# Altium project radxa_cm3_io_board_v1360_schematic.PrjPcb (part 5 of 5)

## Sheet 19.IO_Connector.SchDoc: CM3 IO
size 386 x 246 mm; Page Create Date: March  8, 1995; Page Number: 19; Page Size: B; Comment: radxa_1010; Page Count: 20; RevCode: 1.36; Doc: IO_Connector; DsnPath: D:\WMS\黄工\[RC119]CM3_IO_V1.36\对外资料\radxa_cm3_io_board_v1360.DSN; SchematicName: CM3_IO V1.36; PageName: 19.IO_Connector; PageSize: B; TopSchematic: True
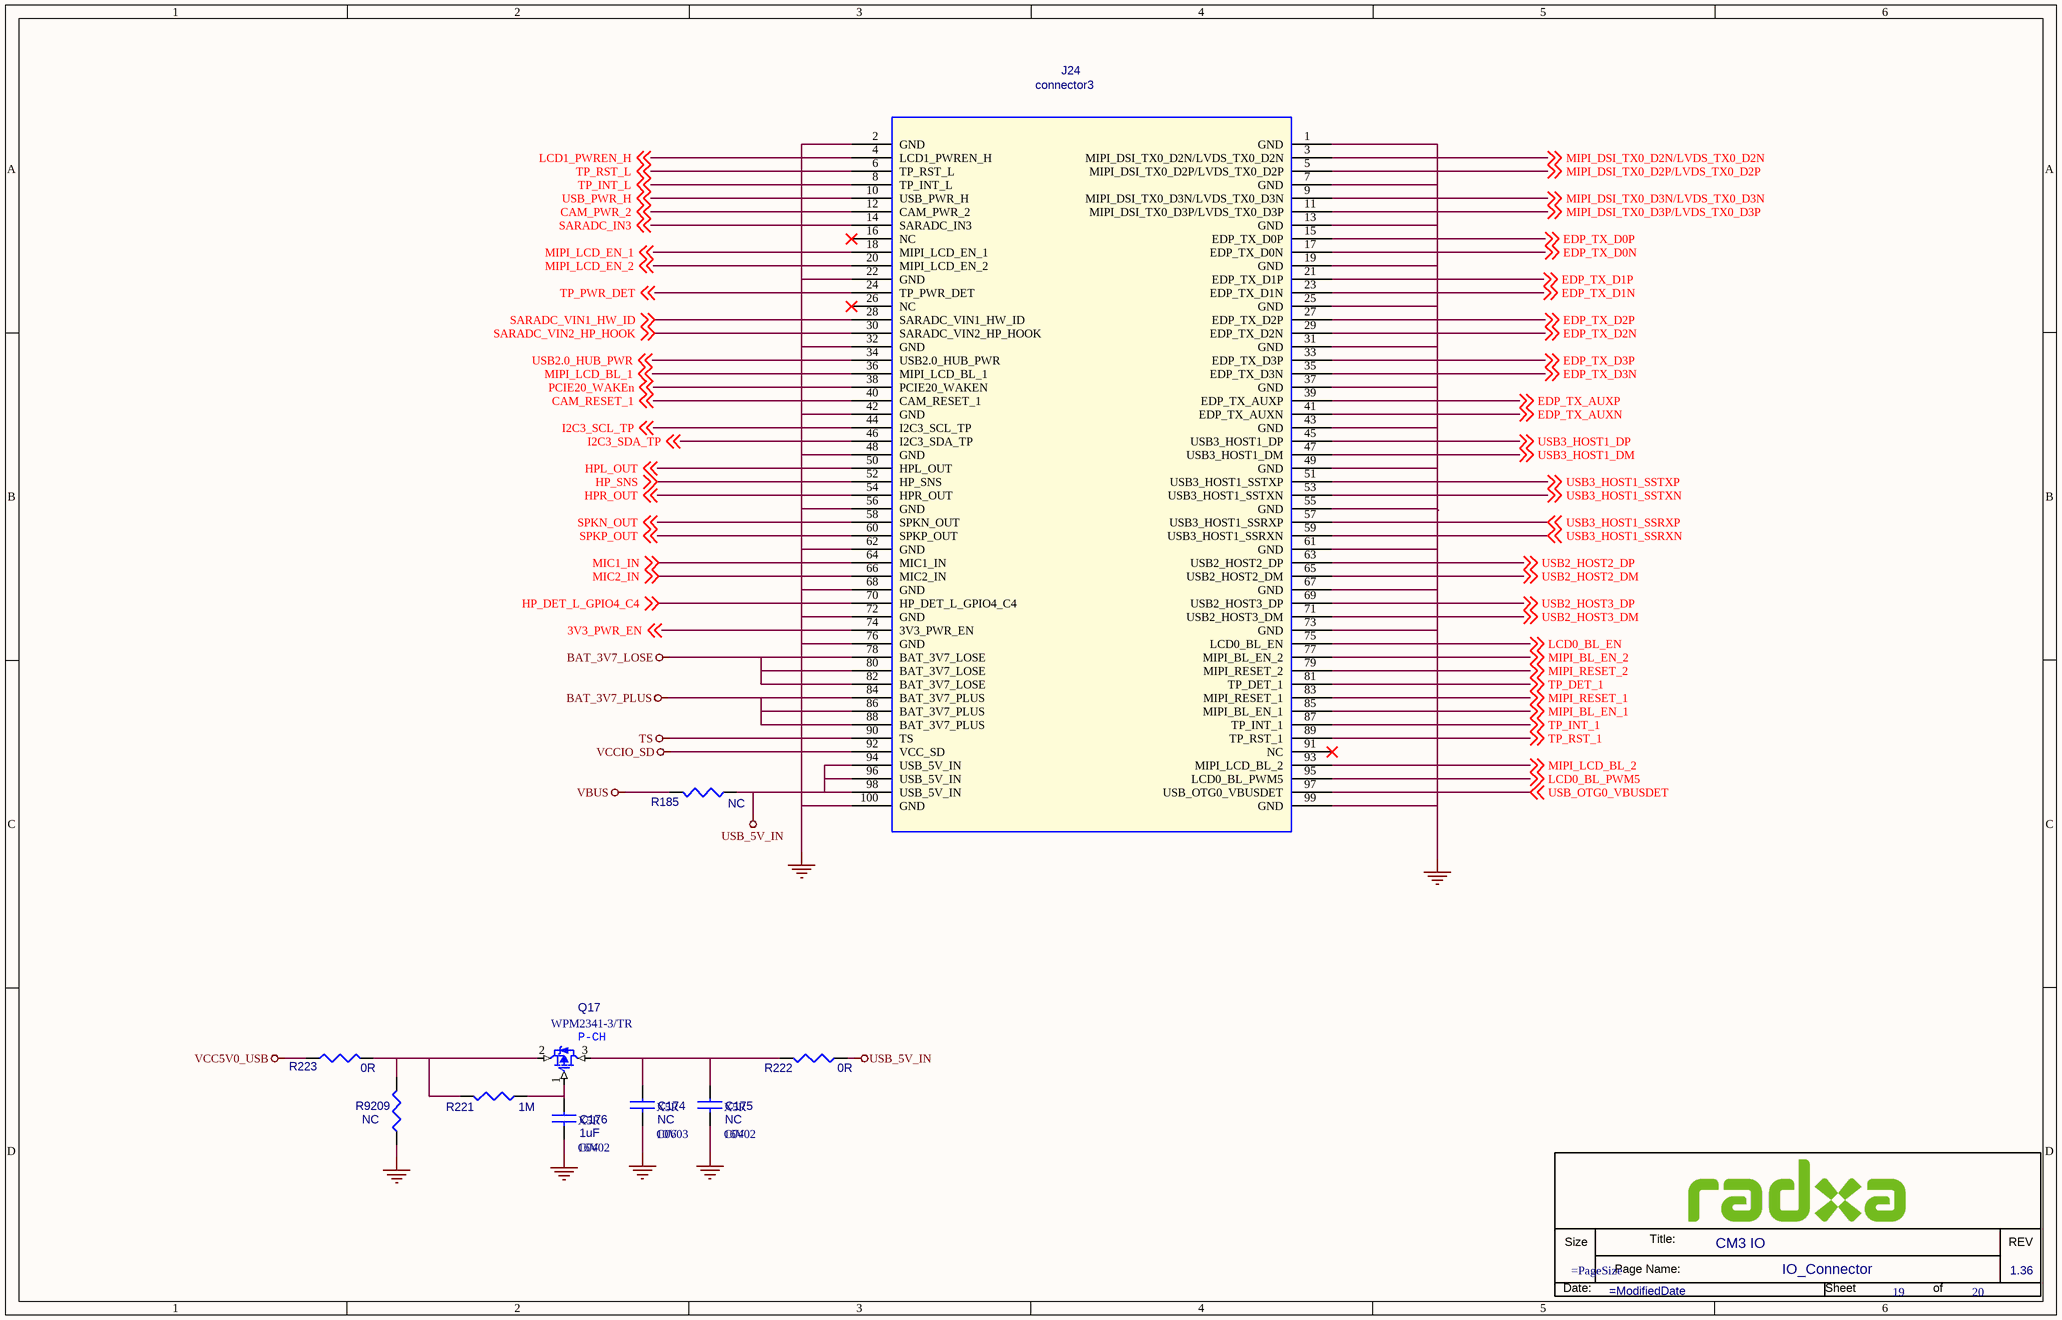
[diagram p17: 19.IO_Connector.SchDoc]

### Parts
(Parts that share a designator on the sheet are numbered #1, #2 ... from top to bottom, then left to right.)
*#18  Doc: IO_Connector  RevCode: 1.36  Title: CM3 IO  Page Number: 19  Page Count: 20  (hidden comment: radxa_1010)  (graphical)
C174  NC  Voltage: 10V  Dielectric: X5R  [C0603]
C175  NC  Voltage: 16V  Dielectric: X5R  [C0402]
C176  1uF  Voltage: 16V  Dielectric: X5R  [C0402]
J24  connector3  [DF40C_100DS]
Q17  WPM2341-3/TR  [S0T-23]
R185  NC  [R0603]
R221  1M  [R0402]
R222  0R  [R0402]
R223  0R  [R0402]
R9209  NC  [R0402]

### Nets
BAT_3V7_LOSE: J24.78(BAT_3V7_LOSE) J24.80(BAT_3V7_LOSE) J24.82(BAT_3V7_LOSE)
BAT_3V7_PLUS: J24.84(BAT_3V7_PLUS) J24.86(BAT_3V7_PLUS) J24.88(BAT_3V7_PLUS)
GND: C174.2 C175.2 C176.2 J24.1(GND) J24.2(GND) J24.7(GND) J24.13(GND) J24.19(GND) J24.22(GND) J24.25(GND) J24.31(GND) J24.32(GND) J24.37(GND) J24.42(GND) J24.43(GND) J24.48(GND) J24.49(GND) J24.55(GND) J24.56(GND) J24.61(GND) J24.62(GND) J24.67(GND) J24.68(GND) J24.72(GND) J24.73(GND) J24.76(GND) J24.99(GND) J24.100(GND) R9209.2
TS: J24.90(TS)
USB_5V_IN: J24.94(USB_5V_IN) J24.96(USB_5V_IN) J24.98(USB_5V_IN) R185.2 R222.2
VBUS: R185.1
VCC5V0_USB: R223.1
VCCIO_SD: J24.92(VCC_SD)
3V3_PWR_EN: J24.74(3V3_PWR_EN) ; off-sheet 3V3_PWR_EN
CAM_PWR_2: J24.12(CAM_PWR_2) ; off-sheet CAM_PWR_2
CAM_RESET_1: J24.40(CAM_RESET_1) ; off-sheet CAM_RESET_1
EDP_TX_AUXN: J24.41(EDP_TX_AUXN) ; off-sheet EDP_TX_AUXN
EDP_TX_AUXP: J24.39(EDP_TX_AUXP) ; off-sheet EDP_TX_AUXP
EDP_TX_D0N: J24.17(EDP_TX_D0N) ; off-sheet EDP_TX_D0N
EDP_TX_D0P: J24.15(EDP_TX_D0P) ; off-sheet EDP_TX_D0P
EDP_TX_D1N: J24.23(EDP_TX_D1N) ; off-sheet EDP_TX_D1N
EDP_TX_D1P: J24.21(EDP_TX_D1P) ; off-sheet EDP_TX_D1P
EDP_TX_D2N: J24.29(EDP_TX_D2N) ; off-sheet EDP_TX_D2N
EDP_TX_D2P: J24.27(EDP_TX_D2P) ; off-sheet EDP_TX_D2P
EDP_TX_D3N: J24.35(EDP_TX_D3N) ; off-sheet EDP_TX_D3N
EDP_TX_D3P: J24.33(EDP_TX_D3P) ; off-sheet EDP_TX_D3P
HP_DET_L_GPIO4_C4: J24.70(HP_DET_L_GPIO4_C4) ; off-sheet HP_DET_L_GPIO4_C4
HP_SNS: J24.52(HP_SNS) ; off-sheet HP_SNS
HPL_OUT: J24.50(HPL_OUT) ; off-sheet HPL_OUT
HPR_OUT: J24.54(HPR_OUT) ; off-sheet HPR_OUT
I2C3_SCL_TP: J24.44(I2C3_SCL_TP) ; off-sheet I2C3_SCL_TP
I2C3_SDA_TP: J24.46(I2C3_SDA_TP) ; off-sheet I2C3_SDA_TP
LCD0_BL_EN: J24.75(LCD0_BL_EN) ; off-sheet LCD0_BL_EN
LCD0_BL_PWM5: J24.95(LCD0_BL_PWM5) ; off-sheet LCD0_BL_PWM5
LCD1_PWREN_H: J24.4(LCD1_PWREN_H) ; off-sheet LCD1_PWREN_H
MIC1_IN: J24.64(MIC1_IN) ; off-sheet MIC1_IN
MIC2_IN: J24.66(MIC2_IN) ; off-sheet MIC2_IN
MIPI_BL_EN_1: J24.85(MIPI_BL_EN_1) ; off-sheet MIPI_BL_EN_1
MIPI_BL_EN_2: J24.77(MIPI_BL_EN_2) ; off-sheet MIPI_BL_EN_2
MIPI_DSI_TX0_D2N/LVDS_TX0_D2N: J24.3(MIPI_DSI_TX0_D2N/LVDS_TX0_D2N) ; off-sheet MIPI_DSI_TX0_D2N/LVDS_TX0_D2N
MIPI_DSI_TX0_D2P/LVDS_TX0_D2P: J24.5(MIPI_DSI_TX0_D2P/LVDS_TX0_D2P) ; off-sheet MIPI_DSI_TX0_D2P/LVDS_TX0_D2P
MIPI_DSI_TX0_D3N/LVDS_TX0_D3N: J24.9(MIPI_DSI_TX0_D3N/LVDS_TX0_D3N) ; off-sheet MIPI_DSI_TX0_D3N/LVDS_TX0_D3N
MIPI_DSI_TX0_D3P/LVDS_TX0_D3P: J24.11(MIPI_DSI_TX0_D3P/LVDS_TX0_D3P) ; off-sheet MIPI_DSI_TX0_D3P/LVDS_TX0_D3P
MIPI_LCD_BL_1: J24.36(MIPI_LCD_BL_1) ; off-sheet MIPI_LCD_BL_1
MIPI_LCD_BL_2: J24.93(MIPI_LCD_BL_2) ; off-sheet MIPI_LCD_BL_2
MIPI_LCD_EN_1: J24.18(MIPI_LCD_EN_1) ; off-sheet MIPI_LCD_EN_1
MIPI_LCD_EN_2: J24.20(MIPI_LCD_EN_2) ; off-sheet MIPI_LCD_EN_2
MIPI_RESET_1: J24.83(MIPI_RESET_1) ; off-sheet MIPI_RESET_1
MIPI_RESET_2: J24.79(MIPI_RESET_2) ; off-sheet MIPI_RESET_2
PCIE20_WAKEn: J24.38(PCIE20_WAKEN) ; off-sheet PCIE20_WAKEn
SARADC_IN3: J24.14(SARADC_IN3) ; off-sheet SARADC_IN3
SARADC_VIN1_HW_ID: J24.28(SARADC_VIN1_HW_ID) ; off-sheet SARADC_VIN1_HW_ID
SARADC_VIN2_HP_HOOK: J24.30(SARADC_VIN2_HP_HOOK) ; off-sheet SARADC_VIN2_HP_HOOK
SPKN_OUT: J24.58(SPKN_OUT) ; off-sheet SPKN_OUT
SPKP_OUT: J24.60(SPKP_OUT) ; off-sheet SPKP_OUT
TP_DET_1: J24.81(TP_DET_1) ; off-sheet TP_DET_1
TP_INT_1: J24.87(TP_INT_1) ; off-sheet TP_INT_1
TP_INT_L: J24.8(TP_INT_L) ; off-sheet TP_INT_L
TP_PWR_DET: J24.24(TP_PWR_DET) ; off-sheet TP_PWR_DET
TP_RST_1: J24.89(TP_RST_1) ; off-sheet TP_RST_1
TP_RST_L: J24.6(TP_RST_L) ; off-sheet TP_RST_L
USB2.0_HUB_PWR: J24.34(USB2.0_HUB_PWR) ; off-sheet USB2.0_HUB_PWR
USB2_HOST2_DM: J24.65(USB2_HOST2_DM) ; off-sheet USB2_HOST2_DM
USB2_HOST2_DP: J24.63(USB2_HOST2_DP) ; off-sheet USB2_HOST2_DP
USB2_HOST3_DM: J24.71(USB2_HOST3_DM) ; off-sheet USB2_HOST3_DM
USB2_HOST3_DP: J24.69(USB2_HOST3_DP) ; off-sheet USB2_HOST3_DP
USB3_HOST1_DM: J24.47(USB3_HOST1_DM) ; off-sheet USB3_HOST1_DM
USB3_HOST1_DP: J24.45(USB3_HOST1_DP) ; off-sheet USB3_HOST1_DP
USB3_HOST1_SSRXN: J24.59(USB3_HOST1_SSRXN) ; off-sheet USB3_HOST1_SSRXN
USB3_HOST1_SSRXP: J24.57(USB3_HOST1_SSRXP) ; off-sheet USB3_HOST1_SSRXP
USB3_HOST1_SSTXN: J24.53(USB3_HOST1_SSTXN) ; off-sheet USB3_HOST1_SSTXN
USB3_HOST1_SSTXP: J24.51(USB3_HOST1_SSTXP) ; off-sheet USB3_HOST1_SSTXP
USB_OTG0_VBUSDET: J24.97(USB_OTG0_VBUSDET) ; off-sheet USB_OTG0_VBUSDET
USB_PWR_H: J24.10(USB_PWR_H) ; off-sheet USB_PWR_H
NetC174_1: C174.1 C175.1 Q17.3(D) R222.1
NetC176_1: C176.1 Q17.1(G) R221.1
NetQ17_2: Q17.2(S) R221.2 R223.2 R9209.1

Not connected (* = marked no-connect by the designer): J24 16(NC)* 26(NC)* 91(NC)*

### Notes on the sheet
- (in symbol P-MOSFET) P-CH
- (in symbol radxa_1010) Size; Title:; REV; Page Name:; Date:; Sheet; of

### Library data of the parts
C174 = CAP NP_0: cap,22.00uF,+/-10%,10V,X5R,C0805; Part Reference: C174; Manufacturer: TDK; RK PN: C2012X5R1A226K125AB; Priority: A; Tolerance: 10%; PCB Footprint: C0603; Value: NC; Part Type: C0805; Manufacturer PN: C2012X5R1A226K125AB; Created by: JJJ
C175 = CAP NP_0: cap,100.00nF,+/-10%,16V,X5R,C0402; Part Reference: C175; Manufacturer: TDK; RK PN: C1005X5R1C104K050BA; Priority: A; Tolerance: 10%; PCB Footprint: C0402; Value: NC; Part Type: C0402; Manufacturer PN: C1005X5R1C104K050BA; Created by: JJJ
C176 = CAP NP_0: cap,100.00nF,+/-10%,16V,X5R,C0402; Part Reference: C176; Manufacturer PN: C1005X5R1C104K050BA; Manufacturer: TDK; Tolerance: 10%; Priority: A; PCB Footprint: C0402; Value: 1uF; Created by: JJJ; Part Type: C0402; RK PN: C1005X5R1C104K050BA
J24 = CN_7: Part Reference: J24; Value: connector3; PCB Footprint: DF40C_100DS
Q17 = P-MOSFET: Part Reference: Q17; SANZ_P/N: SK2301; Value: WPM2341-3/TR; Part Type: MOS管; PCB Footprint: S0T-23
R185 = RESISTOR_0: 通用厚膜电阻,330R,+/-5%,R0402,1/16W.; Part Reference: R185; Manufacturer: YAGEO; RK PN: RC0402JR-07330RL; Priority: A; Tolerance: 5%; Wattage: 1/16W; Value: NC; Part Type: 通用厚膜电阻; Manufacturer PN: RC0402JR-07330RL; Created by: YTL; PCB Footprint: R0603
R221 = RESISTOR_1: RES,thick film,47KOhm,+/-5%,1/16W,SMD0402; Part Reference: R221; Value: 1M; PCB Footprint: R0402
R222 = RESISTOR_0: 通用厚膜电阻,330R,+/-5%,R0402,1/16W.; Part Reference: R222; Manufacturer PN: RC0402JR-07330RL; Manufacturer: YAGEO; Wattage: 1/16W; Tolerance: 5%; Priority: A; Value: 0R; Created by: YTL; Part Type: 通用厚膜电阻; RK PN: RC0402JR-07330RL; PCB Footprint: R0402
R223 = RESISTOR_0: 通用厚膜电阻,330R,+/-5%,R0402,1/16W.; Part Reference: R223; Manufacturer PN: RC0402JR-07330RL; Manufacturer: YAGEO; Wattage: 1/16W; Tolerance: 5%; Priority: A; Value: 0R; Created by: YTL; Part Type: 通用厚膜电阻; RK PN: RC0402JR-07330RL; PCB Footprint: R0402
R9209 = RESISTOR_0: 通用厚膜电阻,100R,+/-5%,R0402,1/16W.; Part Reference: R9209; Manufacturer PN: RC0402JR-07100RL; Manufacturer: YAGEO; Wattage: 1/16W; Tolerance: 5%; Priority: A; Value: NC; Created by: YTL; Part Type: 通用厚膜电阻; RK PN: RC0402JR-07100RL; PCB Footprint: R0402
*#18 = radxa_1010: Page Create Date: March  8, 1995; Page Size: =PageSize; Page Modify Date: =ModifiedDate

## Sheet 20.MIPI_LCD_TX1.SchDoc: CM3 IO
size 420 x 297 mm; Page Create Date: March  8, 1995; Page Number: 20; Page Size: A3; Comment: radxa_1010; Page Count: 20; RevCode: 1.36; Doc: MIPI_LCD_TX1; DsnPath: D:\WMS\黄工\[RC119]CM3_IO_V1.36\对外资料\radxa_cm3_io_board_v1360.DSN; SchematicName: CM3_IO V1.36; PageName: 20.MIPI_LCD_TX1; PageSize: A3; TopSchematic: True
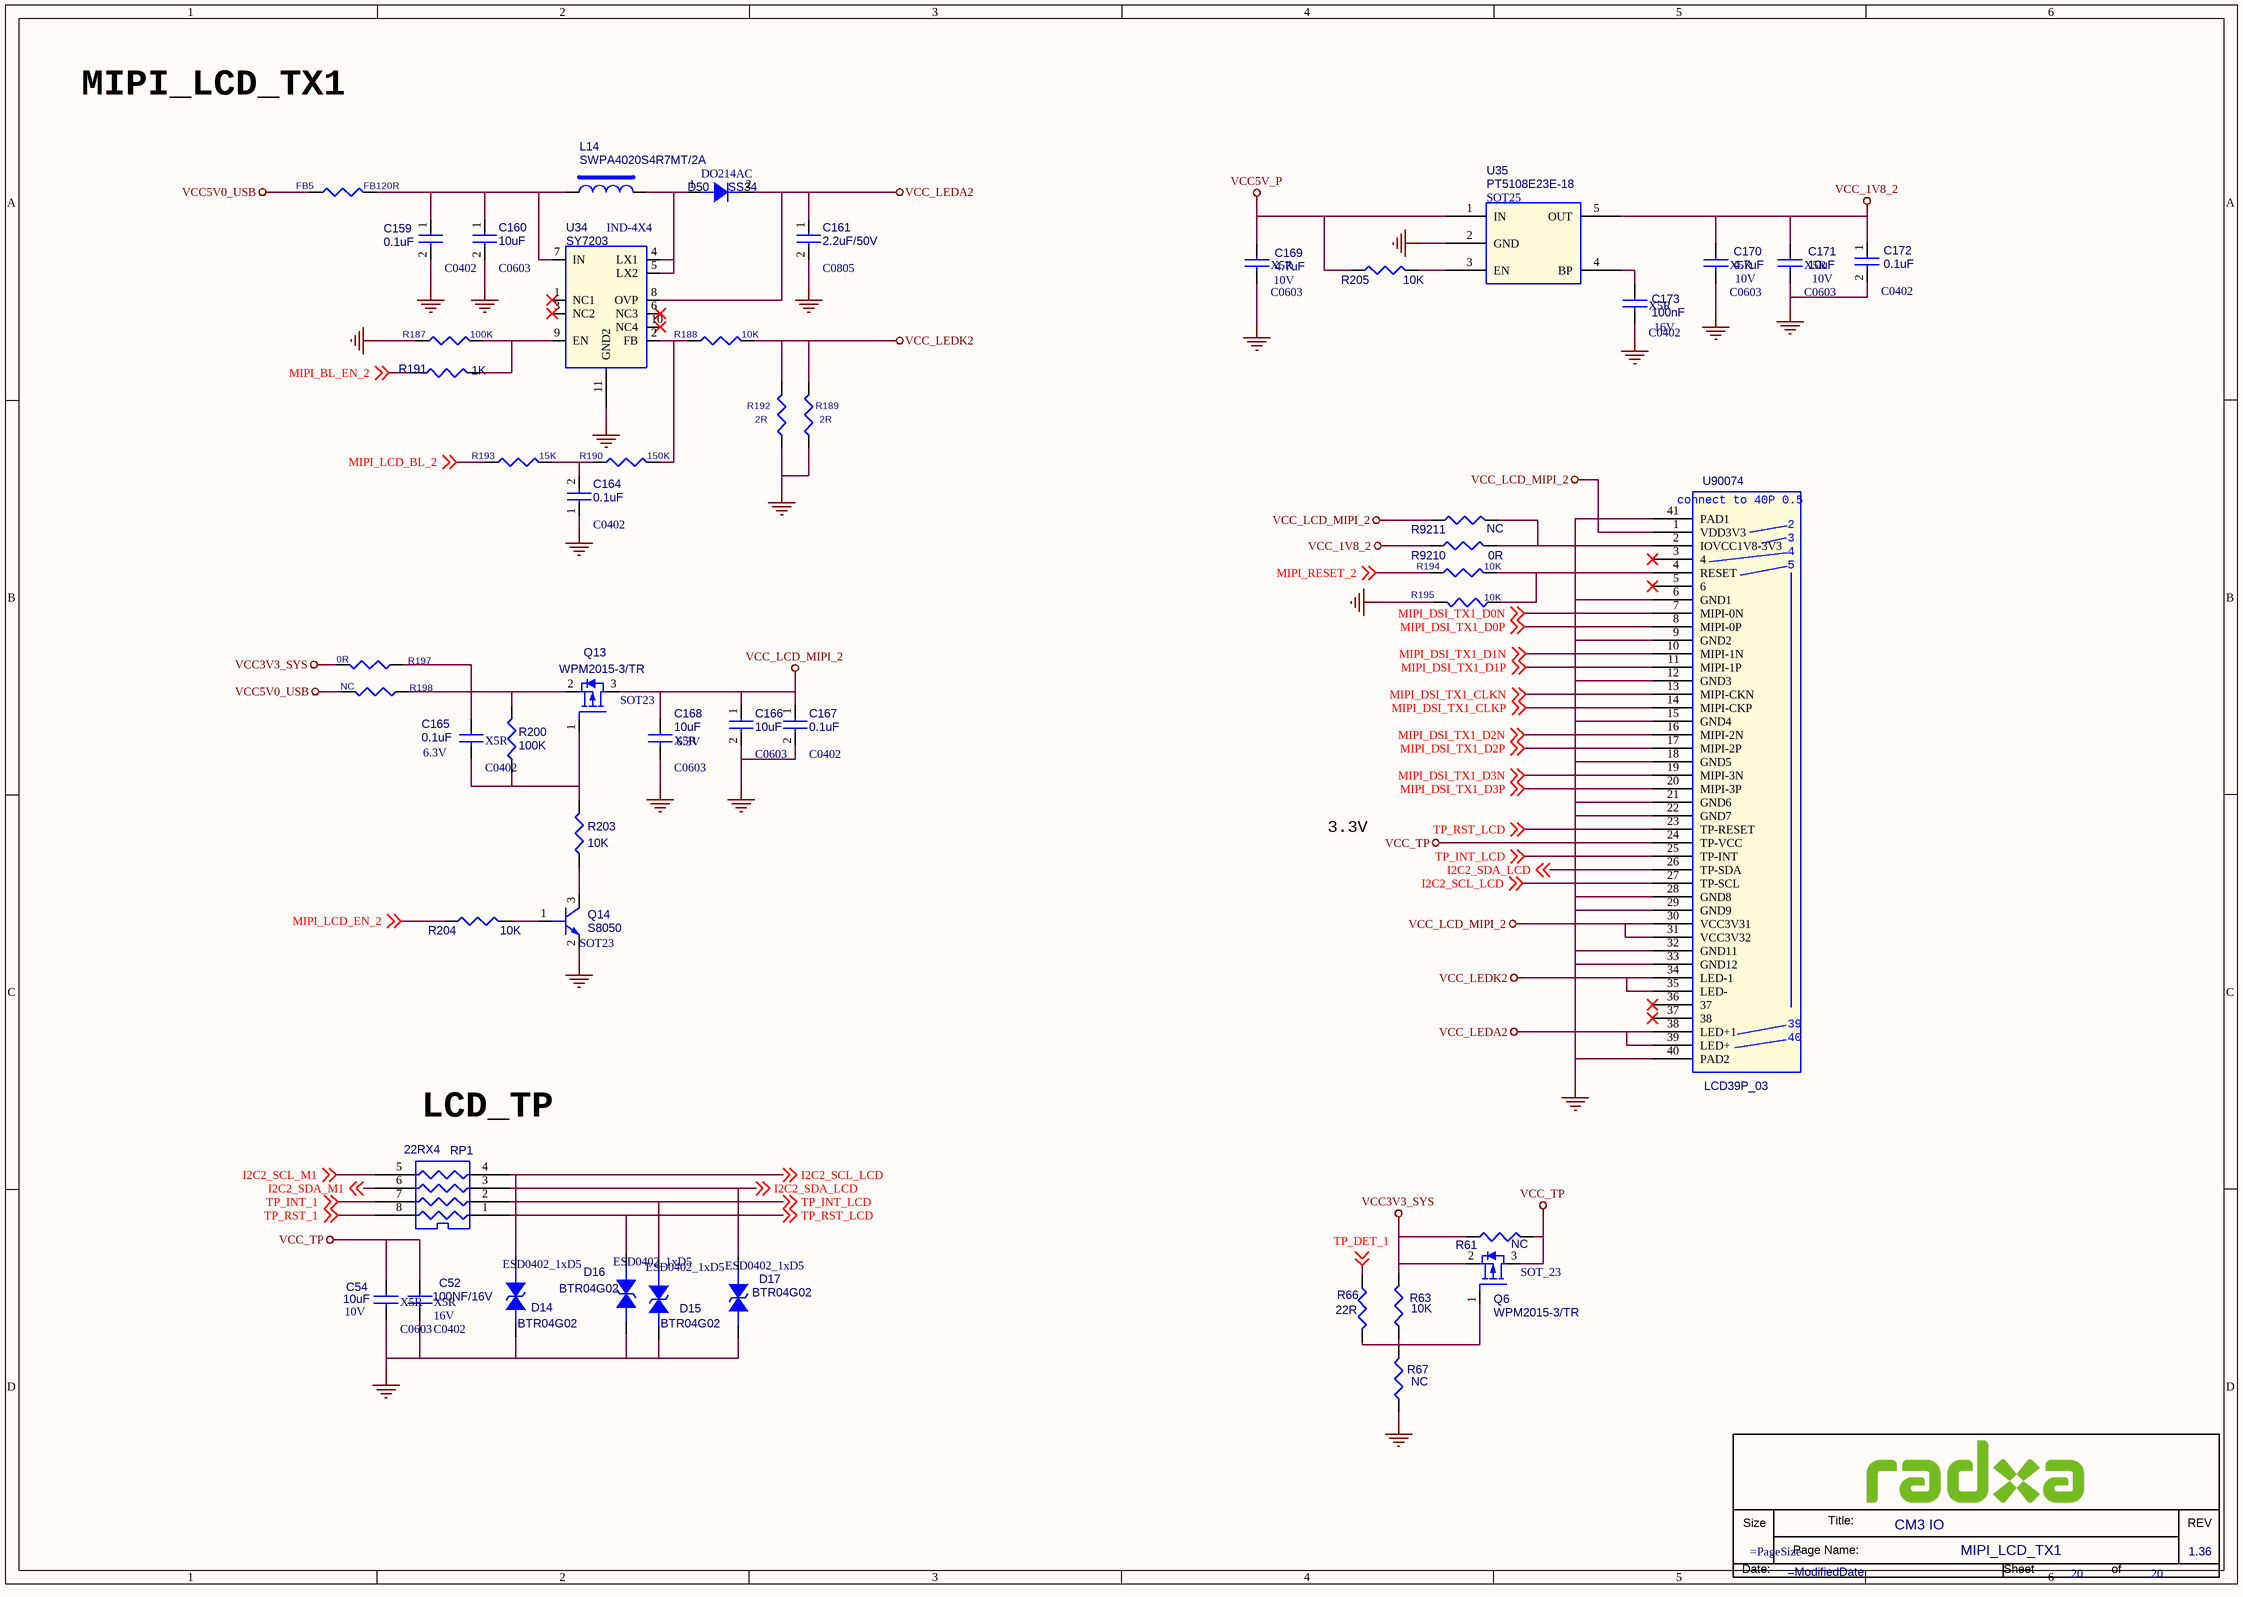
[diagram p18: 20.MIPI_LCD_TX1.SchDoc]

### Parts
(Parts that share a designator on the sheet are numbered #1, #2 ... from top to bottom, then left to right.)
*#19  Doc: MIPI_LCD_TX1  RevCode: 1.36  Title: CM3 IO  Page Number: 20  (hidden comment: radxa_1010)  (graphical)
C52  100NF/16V  Voltage: 16V  Dielectric: X5R  [C0402]
C54  10uF  Voltage: 10V  Dielectric: X5R  [C0603]
C159  0.1uF  [C0402]
C160  10uF  [C0603]
C161  2.2uF/50V  [C0805]
C164  0.1uF  [C0402]
C165  0.1uF  Voltage: 6.3V  Dielectric: X5R  [C0402]
C166  10uF  [C0603]
C167  0.1uF  [C0402]
C168  10uF  Voltage: 6.3V  Dielectric: X5R  [C0603]
C169  4.7uF  Voltage: 10V  Dielectric: X5R  [C0603]
C170  4.7uF  Voltage: 10V  Dielectric: X5R  [C0603]
C171  10uF  Voltage: 10V  Dielectric: X5R  [C0603]
C172  0.1uF  [C0402]
C173  100nF  Voltage: 16V  Dielectric: X5R  [C0402]
D14  BTR04G02  [ESD0402_1xD5]
D15  BTR04G02  [ESD0402_1xD5]
D16  BTR04G02  [ESD0402_1xD5]
D17  BTR04G02  [ESD0402_1xD5]
D50  SS34  [DO214AC]
FB5  FB120R  [R0603]
L14  SWPA4020S4R7MT/2A  [IND-4X4]
Q6  WPM2015-3/TR  PCB Footprint: SOT_23  [SOT23]
Q13  WPM2015-3/TR  [SOT23]
Q14  S8050  [SOT23]
R61  NC  [R0402]
R63  10K  [R0402]
R66  22R  [R0402]
R67  NC  [R0402]
R187  100K  [R0402]
R188  10K  [R0402]
R189  2R  [R0805]
R190  150K  [R0402]
R191  1K  [R0402]
R192  2R  [R0805]
R193  15K  [R0402]
R194  10K  [R0402]
R195  10K  [R0402]
R197  0R  [R0603]
R198  NC  [R0603]
R200  100K  [R0402]
R203  10K  [R0402]
R204  10K  [R0402]
R205  10K  [R0402]
R9210  0R  [R0402]
R9211  NC  [R0402]
RP1  22RX4  [RN8P4RC]
U34  SY7203  [QFN8-2X2]
U35  PT5108E23E-18  [SOT25]
U90074  LCD39P_03  [LCD39PIN-ok]

### Nets
GND: C52.2 C54.2 C159.2 C160.2 C161.2 C164.1 C166.2 C167.2 C168.2 C169.2 C170.2 C171.2 C172.2 C173.2 D14.2 D15.2 D16.2 D17.2 Q14.2(EMITTER) R67.1 R187.1 R189.2 R192.2 R195.2 U34.11(GND2) U35.2(GND) U90074.6(GND1) U90074.9(GND2) U90074.12(GND3) U90074.15(GND4) U90074.18(GND5) U90074.21(GND6) U90074.22(GND7) U90074.28(GND8) U90074.29(GND9) U90074.32(GND11) U90074.33(GND12) U90074.40(PAD2) U90074.41(PAD1)
VCC3V3_SYS: Q6.2(SOURCE) R61.1 R63.2 R197.1
VCC5V0_USB: FB5.1 R198.1
VCC5V_P: C169.1 R205.1 U35.1(IN)
VCC_1V8_2: C170.1 C171.1 C172.1 R9210.1 U35.5(OUT)
VCC_LCD_MIPI_2: C166.1 C167.1 C168.1 Q13.3(DRAIN) R9211.1 U90074.1(VDD3V3) U90074.30(VCC3V31) U90074.31(VCC3V32)
VCC_LEDA2: C161.1 D50.2(K) U34.8(OVP) U90074.38(LED+1) U90074.39(LED+)
VCC_LEDK2: R188.2 R189.1 R192.1 U90074.34(LED-1) U90074.35(LED-)
VCC_TP: C52.1 C54.1 Q6.3(DRAIN) R61.2 U90074.24(TP-VCC)
I2C2_SCL_LCD: D14.1 RP1.4(R4) U90074.27(TP-SCL) ; off-sheet I2C2_SCL_LCD
I2C2_SCL_M1: RP1.5(R4) ; off-sheet I2C2_SCL_M1
I2C2_SDA_LCD: D17.1 RP1.3(R3) U90074.26(TP-SDA) ; off-sheet I2C2_SDA_LCD
I2C2_SDA_M1: RP1.6(R3) ; off-sheet I2C2_SDA_M1
MIPI_BL_EN_2: R191.1 ; off-sheet MIPI_BL_EN_2
MIPI_DSI_TX1_CLKN: U90074.13(MIPI-CKN) ; off-sheet MIPI_DSI_TX1_CLKN
MIPI_DSI_TX1_CLKP: U90074.14(MIPI-CKP) ; off-sheet MIPI_DSI_TX1_CLKP
MIPI_DSI_TX1_D0N: U90074.7(MIPI-0N) ; off-sheet MIPI_DSI_TX1_D0N
MIPI_DSI_TX1_D0P: U90074.8(MIPI-0P) ; off-sheet MIPI_DSI_TX1_D0P
MIPI_DSI_TX1_D1N: U90074.10(MIPI-1N) ; off-sheet MIPI_DSI_TX1_D1N
MIPI_DSI_TX1_D1P: U90074.11(MIPI-1P) ; off-sheet MIPI_DSI_TX1_D1P
MIPI_DSI_TX1_D2N: U90074.16(MIPI-2N) ; off-sheet MIPI_DSI_TX1_D2N
MIPI_DSI_TX1_D2P: U90074.17(MIPI-2P) ; off-sheet MIPI_DSI_TX1_D2P
MIPI_DSI_TX1_D3N: U90074.19(MIPI-3N) ; off-sheet MIPI_DSI_TX1_D3N
MIPI_DSI_TX1_D3P: U90074.20(MIPI-3P) ; off-sheet MIPI_DSI_TX1_D3P
MIPI_LCD_BL_2: R193.1 ; off-sheet MIPI_LCD_BL_2
MIPI_LCD_EN_2: R204.1 ; off-sheet MIPI_LCD_EN_2
MIPI_RESET_2: R194.1 ; off-sheet MIPI_RESET_2
TP_DET_1: R66.1 ; off-sheet TP_DET_1
TP_INT_1: RP1.7(R2) ; off-sheet TP_INT_1
TP_INT_LCD: D15.1 RP1.2(R2) U90074.25(TP-INT) ; off-sheet TP_INT_LCD
TP_RST_1: RP1.8(R1) ; off-sheet TP_RST_1
TP_RST_LCD: D16.1 RP1.1(R1) U90074.23(TP-RESET) ; off-sheet TP_RST_LCD
NetC159_1: C159.1 C160.1 FB5.2 L14.1 U34.7(IN)
NetC164_2: C164.2 R190.1 R193.2
NetC165_1: C165.1 Q13.2(SOURCE) R197.2 R198.2 R200.1
NetC165_2: C165.2 Q13.1(GATE) R200.2 R203.1
NetC173_1: C173.1 U35.4(BP)
NetD50_1: D50.1(A) L14.2 U34.4(LX1) U34.5(LX2)
NetQ6_1: Q6.1(GATE) R63.1 R66.2 R67.2
NetQ14_1: Q14.1(BASE) R204.2
NetQ14_3: Q14.3(COLLECTOR) R203.2
NetR187_2: R187.2 R191.2 U34.9(EN)
NetR188_1: R188.1 R190.2 U34.2(FB)
NetR194_2: R194.2 R195.1 U90074.4(RESET)
NetR205_2: R205.2 U35.3(EN)
NetR9210_2: R9210.2 R9211.2 U90074.2(IOVCC1V8-3V3)

Not connected (* = marked no-connect by the designer): U34 1(NC1)* 3(NC2)* 6(NC3)* 10(NC4)*; U90074 3(4)* 5(6)* 36(37)* 37(38)*

### Notes on the sheet
- MIPI_LCD_TX1
- 3.3V
- (near RP1) LCD_TP
- (in symbol LCD39P_03) connect to 40P 0.5
- (in symbol radxa_1010) Size; Title:; REV; Page Name:; Date:; Sheet; of

### Library data of the parts
C52 = CAP NP_0: cap,100.00nF,+/-10%,16V,X5R,C0402; Part Reference: C52; Manufacturer: TDK; RK PN: C1005X5R1C104K050BA; Priority: A; Tolerance: 10%; PCB Footprint: C0402; Value: 100NF/16V; Part Type: C0402; Manufacturer PN: C1005X5R1C104K050BA; Created by: JJJ
C54 = CAP NP_0: cap,10.00uF,+/-10%,10V,X5R,C0603; Part Reference: C54; Manufacturer PN: C1608X5R1A106K080AC; Manufacturer: TDK; Tolerance: 10%; Priority: A; PCB Footprint: C0603; Value: 10uF; Created by: JJJ; Part Type: C0603; RK PN: C1608X5R1A106K080AC
C159 = CAP NP: CAP,MLCC,100nF,+/-10%,X7R,6.3V,SMD0402; Part Reference: C159; PCB Footprint: C0402; Value: 0.1uF
C160 = CAP NP: Part Reference: C160; PCB Footprint: C0603; Value: 10uF
C161 = CAP NP: RoHS CHIP CAP 1uF +10/-10% 25V X5R; Part Reference: C161; PCB Footprint: C0805; Value: 2.2uF/50V
C164 = CAP NP: RoHS CHIP CAP 0.1uF +10/-10% X7R; Part Reference: C164; PCB Footprint: C0402; Value: 0.1uF
C165 = CAP NP_0: cap,100.00nF,+/-10%,6.3V,X5R,C0402; Part Reference: C165; Manufacturer: TDK; RK PN: C1005X5R0J104K050BA; Priority: A; Tolerance: 10%; PCB Footprint: C0402; Value: 0.1uF; Part Type: C0402; Manufacturer PN: C1005X5R0J104K050BA; Created by: JJJ
C166 = CAP NP: CAP,MLCC,4.7uF,+/-10%,X5R,6.3V,SMD0603; Part Reference: C166; PCB Footprint: C0603; Value: 10uF
C167 = CAP NP: CAP,MLCC,100nF,+/-10%,X7R,6.3V,SMD0402; Part Reference: C167; PCB Footprint: C0402; Value: 0.1uF
C168 = CAP NP_0: cap,4.70uF,+/-10%,6.3V,X5R,C0603; Part Reference: C168; Manufacturer: TDK; RK PN: C1608X5R0J475K080AB; Priority: A; Tolerance: 10%; PCB Footprint: C0603; Value: 10uF; Part Type: C0603; Manufacturer PN: C1608X5R0J475K080AB; Created by: JJJ
C169 = CAP NP_0: cap,4.70uF,+/-10%,10V,X5R,C0603; Part Reference: C169; Manufacturer: TDK; RK PN: C1608X5R1A475K080AC; Priority: A; Tolerance: 10%; PCB Footprint: C0603; Value: 4.7uF; Part Type: C0603; Manufacturer PN: C1608X5R1A475K080AC; Created by: JJJ
C170 = CAP NP_0: cap,4.70uF,+/-10%,10V,X5R,C0603; Part Reference: C170; Manufacturer PN: C1608X5R1A475K080AC; Manufacturer: TDK; Tolerance: 10%; Priority: A; PCB Footprint: C0603; Value: 4.7uF; Created by: JJJ; Part Type: C0603; RK PN: C1608X5R1A475K080AC
C171 = CAP NP_0: cap,10.00uF,+/-10%,10V,X5R,C0805; Part Reference: C171; Manufacturer PN: C2012X5R1A106K125AB; Manufacturer: TDK; Tolerance: 10%; Priority: A; PCB Footprint: C0603; Value: 10uF; Created by: JJJ; Part Type: C0805; RK PN: C2012X5R1A106K125AB
C172 = CAP NP: CAP,MLCC,100nF,+/-10%,X7R,6.3V,SMD0402; Part Reference: C172; PCB Footprint: C0402; Value: 0.1uF
C173 = CAP NP_0: cap,100.00nF,+/-10%,16V,X5R,C0402; Part Reference: C173; Manufacturer: TDK; RK PN: C1005X5R1C104K050BA; Priority: A; Tolerance: 10%; PCB Footprint: C0402; Value: 100nF; Part Type: C0402; Manufacturer PN: C1005X5R1C104K050BA; Created by: JJJ
D14 = DIODE BI_DIR TRIG_0: 1-Line, Bi-directional, Transient Voltage Suppressors.17.5pF.; Part Reference: D14; Manufacturer PN: ESD5451N; Manufacturer: WillSemi(韦尔半导体); OPTION: DNP; Priority: A; PCB Footprint: ESD0402_1xD5; Value: BTR04G02; Created by: JJJ; Part Type: ESD_TVS; RK PN: ESD5451N
D15 = DIODE BI_DIR TRIG_0: 1-Line, Bi-directional, Transient Voltage Suppressors.17.5pF.; Part Reference: D15; Manufacturer: WillSemi(韦尔半导体); RK PN: ESD5451N; Priority: A; OPTION: DNP; PCB Footprint: ESD0402_1xD5; Value: BTR04G02; Part Type: ESD_TVS; Manufacturer PN: ESD5451N; Created by: JJJ
D16 = DIODE BI_DIR TRIG_0: 1-Line, Bi-directional, Transient Voltage Suppressors.17.5pF.; Part Reference: D16; Manufacturer: WillSemi(韦尔半导体); RK PN: ESD5451N; Priority: A; OPTION: DNP; PCB Footprint: ESD0402_1xD5; Value: BTR04G02; Part Type: ESD_TVS; Manufacturer PN: ESD5451N; Created by: JJJ
D17 = DIODE BI_DIR TRIG_0: 1-Line, Bi-directional, Transient Voltage Suppressors.17.5pF.; Part Reference: D17; Manufacturer: WillSemi(韦尔半导体); RK PN: ESD5451N; Priority: A; OPTION: DNP; PCB Footprint: ESD0402_1xD5; Value: BTR04G02; Part Type: ESD_TVS; Manufacturer PN: ESD5451N; Created by: JJJ
D50 = DIODE: Part Reference: D50; PCB Footprint: DO214AC; Value: SS34
FB5 = RES 1B: ROHS CHIP RES 4.7K 1/16W 5%; Part Reference: FB5; Value: FB120R; PCB Footprint: R0603
L14 = INDUCTORS OF FERRITE: Part Reference: L14; PCB Footprint: IND-4X4; Value: SWPA4020S4R7MT/2A
Q6 = MOSFET P: PMOS,WPM2015-3/TR,SOT_23,Id=2.4A,Vds=20V; Part Reference: Q6; Manufacturer: WillSemi(韦尔半导体); ROOM: CHG; Priority: A; Id_max: 2.4A; Vgs: ±8V; VDS: 20V; Vgsth: 0.62V; Pd: 0.5W; option: DNP; Value: WPM2015-3/TR; RK PN: WPM2015-3/TR; Part Type: PMOS; Manufacturer PN: WPM2015-3/TR; Created by: JJJ
Q13 = MOSFET P: PMOS,WPM2015-3/TR,SOT23,Id=2.4A,Vds=20V; Part Reference: Q13; Manufacturer: WillSemi(韦尔半导体); Pd: 0.5W; Vgsth: 0.62V; VDS: 20V; Vgs: ±8V; Id: 2.4A; Priority: A; PCB Footprint: SOT23; Value: WPM2015-3/TR; Created by: JJJ; Manufacturer PN: WPM2015-3/TR; Part Type: PMOS; RK PN: WPM2015-3/TR
Q14 = NPN: S8050 SOT23; Part Reference: Q14; Manufacturer: 长电; Manufacturer PN: S8050_SOT23; Priority: A; Ic: 0.5A; Vceo: 25V; Pc: 0.3W; PCB Footprint: SOT23; Value: S8050; RK PN: S8050; Part Type: NPN; Created by: JJJ
R61 = RESISTOR_0: 通用厚膜电阻,0R,+/-5%,R0402,1/16W.; Part Reference: R61; Manufacturer PN: RC0402JR-070RL; Manufacturer: YAGEO; Wattage: 1/16W; Tolerance: 5%; Priority: A; Value: NC; Created by: YTL; Part Type: 通用厚膜电阻; RK PN: RC0402JR-070RL; PCB Footprint: R0402
R63 = RESISTOR_0: 通用厚膜电阻,10K,+/-5%,R0402,1/16W.; Part Reference: R63; Manufacturer PN: RC0402JR-0710KL; Manufacturer: YAGEO; Wattage: 1/16W; Tolerance: 5%; Priority: A; Value: 10K; Created by: YTL; Part Type: 通用厚膜电阻; RK PN: RC0402JR-0710KL; PCB Footprint: R0402
R66 = RESISTOR_0: 通用厚膜电阻,100K,+/-5%,R0402,1/16W.; Part Reference: R66; Manufacturer: YAGEO; RK PN: RC0402JR-07100KL; Priority: A; Tolerance: 5%; Wattage: 1/16W; Value: 22R; Part Type: 通用厚膜电阻; Manufacturer PN: RC0402JR-07100KL; Created by: YTL; PCB Footprint: R0402
R67 = RESISTOR_0: 通用厚膜电阻,10K,+/-5%,R0402,1/16W.; Part Reference: R67; Manufacturer: YAGEO; RK PN: RC0402JR-0710KL; Priority: A; Tolerance: 5%; Wattage: 1/16W; Value: NC; Part Type: 通用厚膜电阻; Manufacturer PN: RC0402JR-0710KL; Created by: YTL; PCB Footprint: R0402
R187 = RES 1B: ROHS CHIP RES 4.7K 1/16W 5%; Part Reference: R187; Value: 100K; PCB Footprint: R0402
R188 = RES 1B: ROHS CHIP RES 82K 1/16W 5%; Part Reference: R188; Value: 10K; PCB Footprint: R0402
R189 = RES 1B: ROHS CHIP RES 4.7R 1/4W 5%; Part Reference: R189; Value: 2R; PCB Footprint: R0805
R190 = RES 1B: ROHS CHIP RES 4.7K 1/16W 5%; Part Reference: R190; Value: 150K; PCB Footprint: R0402
R191 = RESISTOR_0: 通用厚膜电阻,10K,+/-5%,R0402,1/16W.; Part Reference: R191; Manufacturer PN: RC0402JR-0710KL; Manufacturer: YAGEO; Wattage: 1/16W; Tolerance: 5%; Priority: A; Value: 1K; Created by: YTL; Part Type: 通用厚膜电阻; RK PN: RC0402JR-0710KL; PCB Footprint: R0402
R192 = RES 1B: ROHS CHIP RES 4.7R 1/4W 5%; Part Reference: R192; Value: 2R; PCB Footprint: R0805
R193 = RES 1B: ROHS CHIP RES 4.7K 1/16W 5%; Part Reference: R193; Value: 15K; PCB Footprint: R0402
R194 = RES 1B: ROHS CHIP RES 4.7K 1/16W 5%; Part Reference: R194; Value: 10K; PCB Footprint: R0402
R195 = RES 1B: ROHS CHIP RES 4.7K 1/16W 5%; Part Reference: R195; Value: 10K; PCB Footprint: R0402
R197 = RES 1B: ROHS CHIP RES 4.7R 1/4W 5%; Part Reference: R197; Value: 0R; PCB Footprint: R0603
R198 = RES 1B: ROHS CHIP RES 4.7R 1/4W 5%; Part Reference: R198; Value: NC; PCB Footprint: R0603
R200 = RESISTOR_0: 通用厚膜电阻,100K,+/-5%,R0402,1/16W.; Part Reference: R200; Manufacturer PN: RC0402JR-07100KL; Manufacturer: YAGEO; Wattage: 1/16W; Tolerance: 5%; Priority: A; Value: 100K; Created by: YTL; Part Type: 通用厚膜电阻; RK PN: RC0402JR-07100KL; PCB Footprint: R0402
R203 = RESISTOR_0: 通用厚膜电阻,10K,+/-5%,R0402,1/16W.; Part Reference: R203; Manufacturer PN: RC0402JR-0710KL; Manufacturer: YAGEO; Wattage: 1/16W; Tolerance: 5%; Priority: A; Value: 10K; Created by: YTL; Part Type: 通用厚膜电阻; RK PN: RC0402JR-0710KL; PCB Footprint: R0402
R204 = RESISTOR_0: 通用厚膜电阻,10K,+/-5%,R0402,1/16W.; Part Reference: R204; Manufacturer PN: RC0402JR-0710KL; Manufacturer: YAGEO; Wattage: 1/16W; Tolerance: 5%; Priority: A; Value: 10K; Created by: YTL; Part Type: 通用厚膜电阻; RK PN: RC0402JR-0710KL; PCB Footprint: R0402
R205 = RESISTOR_0: 通用厚膜电阻,10K,+/-5%,R0402,1/16W.; Part Reference: R205; Manufacturer: YAGEO; RK PN: RC0402JR-0710KL; Priority: A; Tolerance: 5%; Wattage: 1/16W; Value: 10K; Part Type: 通用厚膜电阻; Manufacturer PN: RC0402JR-0710KL; Created by: YTL; PCB Footprint: R0402
R9210 = RESISTOR_0: 通用厚膜电阻,10K,+/-5%,R0402,1/16W.; Part Reference: R9210; Manufacturer PN: RC0402JR-0710KL; Manufacturer: YAGEO; Wattage: 1/16W; Tolerance: 5%; Priority: A; Value: 0R; Created by: YTL; Part Type: 通用厚膜电阻; RK PN: RC0402JR-0710KL; PCB Footprint: R0402
R9211 = RESISTOR_0: 通用厚膜电阻,10K,+/-5%,R0402,1/16W.; Part Reference: R9211; Manufacturer PN: RC0402JR-0710KL; Manufacturer: YAGEO; Wattage: 1/16W; Tolerance: 5%; Priority: A; Value: NC; Created by: YTL; Part Type: 通用厚膜电阻; RK PN: RC0402JR-0710KL; PCB Footprint: R0402
RP1 = R-PACK4: Part Reference: RP1; Value: 22RX4; PCB Footprint: RN8P4RC
U34 = MP3202-QFN8_1: Part Reference: U34; PCB Footprint: DFN10P_3X3; Value: SY7203
U35 = LDO_PT5108: 500mA, Low Dropout, Low Noise Ultra-Fast Without Bypass Capacitor CMOS LDO Regulator; Part Reference: U35; Manufacturer PN: RT9013-30GB; Manufacturer: Richtek（立錡）; Priority: A; RK PN: RT9013-30B; Option: /CE75B30M; PCB Footprint: SOT25; Value: PT5108E23E-18; Created by: JJJ; Part Type: LDO
U90074 = LCD39P_03: Part Reference: U90074; Value: LCD39P_03; PCB Footprint: LCD39PIN-ok
*#19 = radxa_1010: Page Create Date: March  8, 1995; Page Size: =PageSize; Page Count: 20; Page Modify Date: =ModifiedDate

## Nets that join several sheets
+1V8: 08.AUDIO (C36.1 R34.2), 16.40PIN CONNECT (R171.2), 17.GPIO+VCC_Connector (U33.88 U33.90)
+3V3: 16.40PIN CONNECT (R170.2 R176.2), 17.GPIO+VCC_Connector (U33.84 U33.86)
+5V_INPUT: 04.HDMI0 OUT (D1.1), 14.FAN_RTC_BAT (R29.1), 15.Power-DC IN (14 pins), 17.GPIO+VCC_Connector (6 pins)
BAT_3V7_LOSE: 14.FAN_RTC_BAT (BAT1.2 P3.1), 19.IO_Connector (J24.78 J24.80 J24.82)
BAT_3V7_PLUS: 14.FAN_RTC_BAT (BAT1.1 D42.1 P1.1), 19.IO_Connector (J24.84 J24.86 J24.88)
GND: 04.HDMI0 OUT (18 pins), 05.Ethernet (11 pins), 06.MicroSD Card (16 pins), 07.PCIE2.0 (41 pins), 08.AUDIO (13 pins), 09.LCD_eDP TX (38 pins), 10.MIPI_LCD_TX0 (27 pins), 11.MIPI_CSI_RX (19 pins), 12.USB OTG_ HUB (49 pins), 13.USB HOST (36 pins), 14.FAN_RTC_BAT (12 pins), 15.Power-DC IN (47 pins), 16.40PIN CONNECT (20 pins), 17.GPIO+VCC_Connector (21 pins), 18.High Speed Serial_Connector (34 pins), 19.IO_Connector (29 pins), 20.MIPI_LCD_TX1 (39 pins)
GPIO_VREF: 16.40PIN CONNECT (7 pins), 17.GPIO+VCC_Connector (U33.78)
TS: 14.FAN_RTC_BAT (BAT1.3 P2.1), 19.IO_Connector (J24.90)
VBUS: 12.USB OTG_ HUB (C86.1 J16.1 R100.2), 19.IO_Connector (R185.1)
VCC3V3_SYS: 05.Ethernet (R4.2 R10.2), 06.MicroSD Card (R9212.2), 07.PCIE2.0 (5 pins), 09.LCD_eDP TX (5 pins), 10.MIPI_LCD_TX0 (R62.1), 11.MIPI_CSI_RX (5 pins), 13.USB HOST (5 pins), 14.FAN_RTC_BAT (D43.2 R138.2 R139.1), 15.Power-DC IN (8 pins), 16.40PIN CONNECT (CON1.1 CON1.17 R169.2), 20.MIPI_LCD_TX1 (Q6.2 R61.1 R63.2 R197.1)
VCC5V0_USB: 10.MIPI_LCD_TX0 (FB1.1 R64.1), 12.USB OTG_ HUB (6 pins), 13.USB HOST (C99.1 U20.5), 15.Power-DC IN (7 pins), 16.40PIN CONNECT (CON1.2 CON1.4), 19.IO_Connector (R223.1), 20.MIPI_LCD_TX1 (FB5.1 R198.1)
VCC5V_P: 10.MIPI_LCD_TX0 (C59.1 R70.1 U11.1), 12.USB OTG_ HUB (C85.1 L4.1), 15.Power-DC IN (C157.1 C158.1 Q10.3 R162.1), 20.MIPI_LCD_TX1 (C169.1 R205.1 U35.1)
VCC12V: 07.PCIE2.0 (11 pins), 09.LCD_eDP TX (C38.1 Q2.2 R36.1 R37.1), 15.Power-DC IN (7 pins)
3V3_PWR_EN: 15.Power-DC IN (R159.1 R165.2 R166.1), 19.IO_Connector (J24.74)
4G_DISABLE: 16.40PIN CONNECT (CON1.26), 17.GPIO+VCC_Connector (U33.37)
AIN0: 16.40PIN CONNECT (U30.5), 17.GPIO+VCC_Connector (U33.96)
AIN1: 16.40PIN CONNECT (U30.6), 17.GPIO+VCC_Connector (U33.94)
BT_nDis: 16.40PIN CONNECT (U31.3), 17.GPIO+VCC_Connector (U33.91)
CAM_GPIO: 11.MIPI_CSI_RX (J2.5), 17.GPIO+VCC_Connector (U33.97)
CAM_PWR_2: 11.MIPI_CSI_RX (J5.5), 19.IO_Connector (J24.12)
EDP_TX_AUXN: 09.LCD_eDP TX (C44.2), 19.IO_Connector (J24.41)
EDP_TX_AUXP: 09.LCD_eDP TX (C43.1), 19.IO_Connector (J24.39)
EDP_TX_D0N: 09.LCD_eDP TX (J11.12), 19.IO_Connector (J24.17)
EDP_TX_D0P: 09.LCD_eDP TX (J11.13), 19.IO_Connector (J24.15)
EDP_TX_D1N: 09.LCD_eDP TX (J11.9), 19.IO_Connector (J24.23)
EDP_TX_D1P: 09.LCD_eDP TX (J11.10), 19.IO_Connector (J24.21)
EDP_TX_D2N: 09.LCD_eDP TX (J11.6), 19.IO_Connector (J24.29)
EDP_TX_D2P: 09.LCD_eDP TX (J11.7), 19.IO_Connector (J24.27)
EDP_TX_D3N: 09.LCD_eDP TX (J11.3), 19.IO_Connector (J24.35)
EDP_TX_D3P: 09.LCD_eDP TX (J11.4), 19.IO_Connector (J24.33)
EEPROM_nWP: 16.40PIN CONNECT (U30.4), 17.GPIO+VCC_Connector (U33.20)
HDMI_TX0N_PORT: 04.HDMI0 OUT (J1.9 U2.2 U2.9), 18.High Speed Serial_Connector (U33.184)
HDMI_TX0P_PORT: 04.HDMI0 OUT (J1.7 U2.1 U2.10), 18.High Speed Serial_Connector (U33.182)
HDMI_TX1N_PORT: 04.HDMI0 OUT (J1.6 U1.5 U1.6), 18.High Speed Serial_Connector (U33.178)
HDMI_TX1P_PORT: 04.HDMI0 OUT (J1.4 U1.4 U1.7), 18.High Speed Serial_Connector (U33.176)
HDMI_TX2N_PORT: 04.HDMI0 OUT (J1.3 U1.2 U1.9), 18.High Speed Serial_Connector (U33.172)
HDMI_TX2P_PORT: 04.HDMI0 OUT (J1.1 U1.1 U1.10), 18.High Speed Serial_Connector (U33.170)
HDMI_TX_CEC_PORT: 04.HDMI0 OUT (ED4.1 J1.13), 18.High Speed Serial_Connector (U33.151)
HDMI_TX_HPD_PORT: 04.HDMI0 OUT (ED1.1 J1.19), 18.High Speed Serial_Connector (U33.153)
HDMI_TXCLKN_PORT: 04.HDMI0 OUT (J1.12 U2.5 U2.6), 18.High Speed Serial_Connector (U33.190)
HDMI_TXCLKP_PORT: 04.HDMI0 OUT (J1.10 U2.4 U2.7), 18.High Speed Serial_Connector (U33.188)
HDMI_TXDDC_SCL_PORT: 04.HDMI0 OUT (ED3.1 J1.15), 18.High Speed Serial_Connector (U33.200)
HDMI_TXDDC_SDA_PORT: 04.HDMI0 OUT (ED2.1 J1.16), 18.High Speed Serial_Connector (U33.199)
HP_DET_L_GPIO4_C4: 08.AUDIO (R31.2), 19.IO_Connector (J24.70)
HP_SNS: 08.AUDIO (R30.2), 19.IO_Connector (J24.52)
HPL_OUT: 08.AUDIO (R16.2), 19.IO_Connector (J24.50)
HPR_OUT: 08.AUDIO (R19.2), 19.IO_Connector (J24.54)
I2C0_SCL_PMIC: 11.MIPI_CSI_RX (J2.3), 17.GPIO+VCC_Connector (U33.80)
I2C0_SDA_PMIC: 11.MIPI_CSI_RX (J2.2), 17.GPIO+VCC_Connector (U33.82)
I2C2_SCL_M1: 11.MIPI_CSI_RX (J5.3), 14.FAN_RTC_BAT (R140.1), 16.40PIN CONNECT (CON1.28), 17.GPIO+VCC_Connector (U33.35), 20.MIPI_LCD_TX1 (RP1.5)
I2C2_SCL_MO: 16.40PIN CONNECT (CON1.5), 17.GPIO+VCC_Connector (U33.56)
I2C2_SDA_M1: 11.MIPI_CSI_RX (J5.2), 14.FAN_RTC_BAT (R141.1), 16.40PIN CONNECT (CON1.27), 17.GPIO+VCC_Connector (U33.36), 20.MIPI_LCD_TX1 (RP1.6)
I2C2_SDA_MO: 16.40PIN CONNECT (CON1.3), 17.GPIO+VCC_Connector (U33.58)
I2C3_SCL_TP: 09.LCD_eDP TX (R49.1), 19.IO_Connector (J24.44)
I2C3_SDA_TP: 09.LCD_eDP TX (R48.1), 19.IO_Connector (J24.46)
I2S1_LRCK_RX_M1: 11.MIPI_CSI_RX (R80.2), 16.40PIN CONNECT (CON1.36), 17.GPIO+VCC_Connector (U33.29)
I2S1_LRCK_TX_M1: 16.40PIN CONNECT (CON1.35), 17.GPIO+VCC_Connector (U33.26)
I2S1_MCLK_M1: 07.PCIE2.0 (R28.2), 16.40PIN CONNECT (CON1.22), 17.GPIO+VCC_Connector (U33.41)
I2S1_SCLK_TX_M1: 13.USB HOST (R135.2), 16.40PIN CONNECT (CON1.12), 17.GPIO+VCC_Connector (U33.49)
I2S1_SDI0_M1: 16.40PIN CONNECT (CON1.38), 17.GPIO+VCC_Connector (U33.27)
I2S1_SDI1_M1: 16.40PIN CONNECT (CON1.18), 17.GPIO+VCC_Connector (U33.45)
I2S1_SDI2_M1: 16.40PIN CONNECT (CON1.16), 17.GPIO+VCC_Connector (U33.47)
I2S1_SDI3_M1: 16.40PIN CONNECT (CON1.7), 17.GPIO+VCC_Connector (U33.54)
I2S1_SDO0_M1: 16.40PIN CONNECT (CON1.40), 17.GPIO+VCC_Connector (U33.25)
I2S1_SDO2_M1: 16.40PIN CONNECT (CON1.29), 17.GPIO+VCC_Connector (U33.34)
LCD0_BL_EN: 09.LCD_eDP TX (J11.32), 19.IO_Connector (J24.75)
LCD0_BL_PWM5: 09.LCD_eDP TX (J11.33 R43.1), 19.IO_Connector (J24.95)
LCD1_PWREN_H: 09.LCD_eDP TX (R41.1 U9.4), 19.IO_Connector (J24.4)
MIC1_IN: 08.AUDIO (6 pins), 19.IO_Connector (J24.64)
MIC2_IN: 08.AUDIO (C64.2 J10.1 R73.2), 19.IO_Connector (J24.66)
MIPI_BL_EN_1: 10.MIPI_LCD_TX0 (R54.1), 19.IO_Connector (J24.85)
MIPI_BL_EN_2: 19.IO_Connector (J24.77), 20.MIPI_LCD_TX1 (R191.1)
MIPI_CSI_RX_CLK0N: 11.MIPI_CSI_RX (J2.8), 18.High Speed Serial_Connector (U33.127)
MIPI_CSI_RX_CLK0P: 11.MIPI_CSI_RX (J2.7), 18.High Speed Serial_Connector (U33.129)
MIPI_CSI_RX_CLK1N: 11.MIPI_CSI_RX (J5.8), 18.High Speed Serial_Connector (U33.140)
MIPI_CSI_RX_CLK1P: 11.MIPI_CSI_RX (J5.7), 18.High Speed Serial_Connector (U33.142)
MIPI_CSI_RX_D0N: 11.MIPI_CSI_RX (J2.14), 18.High Speed Serial_Connector (U33.115)
MIPI_CSI_RX_D0P: 11.MIPI_CSI_RX (J2.13), 18.High Speed Serial_Connector (U33.117)
MIPI_CSI_RX_D1N: 11.MIPI_CSI_RX (J2.11), 18.High Speed Serial_Connector (U33.121)
MIPI_CSI_RX_D1P: 11.MIPI_CSI_RX (J2.10), 18.High Speed Serial_Connector (U33.123)
MIPI_CSI_RX_D2N: 11.MIPI_CSI_RX (J5.14), 18.High Speed Serial_Connector (U33.128)
MIPI_CSI_RX_D2P: 11.MIPI_CSI_RX (J5.13), 18.High Speed Serial_Connector (U33.130)
MIPI_CSI_RX_D3N: 11.MIPI_CSI_RX (J5.11), 18.High Speed Serial_Connector (U33.134)
MIPI_CSI_RX_D3P: 11.MIPI_CSI_RX (J5.10), 18.High Speed Serial_Connector (U33.136)
MIPI_DSI_TX0_CLKN/LVDS_TX0_CLKN: 10.MIPI_LCD_TX0 (LCD1.18), 18.High Speed Serial_Connector (U33.169)
MIPI_DSI_TX0_CLKP/LVDS_TX0_CLKP: 10.MIPI_LCD_TX0 (LCD1.17), 18.High Speed Serial_Connector (U33.171)
MIPI_DSI_TX0_D0N/LVDS_TX0_D0N: 10.MIPI_LCD_TX0 (LCD1.21), 18.High Speed Serial_Connector (U33.157)
MIPI_DSI_TX0_D0P/LVDS_TX0_D0P: 10.MIPI_LCD_TX0 (LCD1.20), 18.High Speed Serial_Connector (U33.159)
MIPI_DSI_TX0_D1N/LVDS_TX0_D1N: 10.MIPI_LCD_TX0 (LCD1.15), 18.High Speed Serial_Connector (U33.163)
MIPI_DSI_TX0_D1P/LVDS_TX0_D1P: 10.MIPI_LCD_TX0 (LCD1.14), 18.High Speed Serial_Connector (U33.165)
MIPI_DSI_TX0_D2N/LVDS_TX0_D2N: 10.MIPI_LCD_TX0 (LCD1.12), 19.IO_Connector (J24.3)
MIPI_DSI_TX0_D2P/LVDS_TX0_D2P: 10.MIPI_LCD_TX0 (LCD1.11), 19.IO_Connector (J24.5)
MIPI_DSI_TX0_D3N/LVDS_TX0_D3N: 10.MIPI_LCD_TX0 (LCD1.24), 19.IO_Connector (J24.9)
MIPI_DSI_TX0_D3P/LVDS_TX0_D3P: 10.MIPI_LCD_TX0 (LCD1.23), 19.IO_Connector (J24.11)
MIPI_DSI_TX1_CLKN: 18.High Speed Serial_Connector (U33.187), 20.MIPI_LCD_TX1 (U90074.13)
MIPI_DSI_TX1_CLKP: 18.High Speed Serial_Connector (U33.189), 20.MIPI_LCD_TX1 (U90074.14)
MIPI_DSI_TX1_D0N: 18.High Speed Serial_Connector (U33.175), 20.MIPI_LCD_TX1 (U90074.7)
MIPI_DSI_TX1_D0P: 18.High Speed Serial_Connector (U33.177), 20.MIPI_LCD_TX1 (U90074.8)
MIPI_DSI_TX1_D1N: 18.High Speed Serial_Connector (U33.181), 20.MIPI_LCD_TX1 (U90074.10)
MIPI_DSI_TX1_D1P: 18.High Speed Serial_Connector (U33.183), 20.MIPI_LCD_TX1 (U90074.11)
MIPI_DSI_TX1_D2N: 18.High Speed Serial_Connector (U33.193), 20.MIPI_LCD_TX1 (U90074.16)
MIPI_DSI_TX1_D2P: 18.High Speed Serial_Connector (U33.195), 20.MIPI_LCD_TX1 (U90074.17)
MIPI_DSI_TX1_D3N: 18.High Speed Serial_Connector (U33.194), 20.MIPI_LCD_TX1 (U90074.19)
MIPI_DSI_TX1_D3P: 18.High Speed Serial_Connector (U33.196), 20.MIPI_LCD_TX1 (U90074.20)
MIPI_LCD_BL_1: 10.MIPI_LCD_TX0 (R57.1), 19.IO_Connector (J24.36)
MIPI_LCD_BL_2: 19.IO_Connector (J24.93), 20.MIPI_LCD_TX1 (R193.1)
MIPI_LCD_EN_1: 10.MIPI_LCD_TX0 (R69.1), 19.IO_Connector (J24.18)
MIPI_LCD_EN_2: 19.IO_Connector (J24.20), 20.MIPI_LCD_TX1 (R204.1)
MIPI_RESET_1: 10.MIPI_LCD_TX0 (R59.2), 19.IO_Connector (J24.83)
MIPI_RESET_2: 19.IO_Connector (J24.79), 20.MIPI_LCD_TX1 (R194.1)
nPWR_LED: 16.40PIN CONNECT (R178.1 R179.2), 17.GPIO+VCC_Connector (U33.95)
PCIE20_CLKREQn_M2: 07.PCIE2.0 (J6.B12), 18.High Speed Serial_Connector (U33.102)
PCIE20_REFCLKN: 07.PCIE2.0 (J6.A14), 18.High Speed Serial_Connector (U33.112)
PCIE20_REFCLKP: 07.PCIE2.0 (J6.A13), 18.High Speed Serial_Connector (U33.110)
PCIE20_RXN: 07.PCIE2.0 (U8.7), 18.High Speed Serial_Connector (U33.118)
PCIE20_RXP: 07.PCIE2.0 (U8.6), 18.High Speed Serial_Connector (U33.116)
PCIE20_TXN: 07.PCIE2.0 (U8.3), 18.High Speed Serial_Connector (U33.124)
PCIE20_TXP: 07.PCIE2.0 (U8.2), 18.High Speed Serial_Connector (U33.122)
PCIE20_WAKEn: 07.PCIE2.0 (J6.B11), 19.IO_Connector (J24.38)
Pcie_nRST: 07.PCIE2.0 (J6.A11), 18.High Speed Serial_Connector (U33.109)
PHY1_LED0_Y1: 05.Ethernet (R6.1), 17.GPIO+VCC_Connector (U33.19)
PHY1_LED1_G: 05.Ethernet (D3.2 R2.2 R3.1), 17.GPIO+VCC_Connector (U33.17)
PHY1_LED2_Y: 05.Ethernet (R5.1), 17.GPIO+VCC_Connector (U33.15)
PHY1_MDI0+: 05.Ethernet (J3.1 U5.1 U5.10), 17.GPIO+VCC_Connector (U33.12)
PHY1_MDI0-: 05.Ethernet (J3.2 U5.2 U5.9), 17.GPIO+VCC_Connector (U33.10)
PHY1_MDI1+: 05.Ethernet (J3.3 U5.4 U5.7), 17.GPIO+VCC_Connector (U33.4)
PHY1_MDI1-: 05.Ethernet (J3.6 U5.5 U5.6), 17.GPIO+VCC_Connector (U33.6)
PHY1_MDI2+: 05.Ethernet (J3.7 U6.1 U6.10), 17.GPIO+VCC_Connector (U33.11)
PHY1_MDI2-: 05.Ethernet (J3.8 U6.2 U6.9), 17.GPIO+VCC_Connector (U33.9)
PHY1_MDI3+: 05.Ethernet (J3.9 U6.4 U6.7), 17.GPIO+VCC_Connector (U33.3)
PHY1_MDI3-: 05.Ethernet (J3.10 U6.5 U6.6), 17.GPIO+VCC_Connector (U33.5)
PI_nLED_Activity: 16.40PIN CONNECT (R183.2), 17.GPIO+VCC_Connector (U33.21)
PMIC_RESET_KEY: 14.FAN_RTC_BAT (R142.1), 17.GPIO+VCC_Connector (U33.100)
PMW0_M0: 16.40PIN CONNECT (CON1.13), 17.GPIO+VCC_Connector (U33.48)
PMW0_M1: 14.FAN_RTC_BAT (R71.1), 16.40PIN CONNECT (CON1.11), 17.GPIO+VCC_Connector (U33.50)
PMW4: 16.40PIN CONNECT (CON1.15), 17.GPIO+VCC_Connector (U33.46)
PWM3_IR: 16.40PIN CONNECT (CON1.37), 17.GPIO+VCC_Connector (U33.24)
PWM11: 16.40PIN CONNECT (CON1.32), 17.GPIO+VCC_Connector (U33.31)
PWRON_KEY: 14.FAN_RTC_BAT (R143.1), 16.40PIN CONNECT (U30.14 U32.1), 17.GPIO+VCC_Connector (U33.99)
RECOVERY: 16.40PIN CONNECT (U30.2), 17.GPIO+VCC_Connector (U33.93)
RUN_PG: 16.40PIN CONNECT (R172.2 U32.3), 17.GPIO+VCC_Connector (U33.92)
SARADC_IN3: 15.Power-DC IN (R153.1), 19.IO_Connector (J24.14)
SARADC_VIN2_HP_HOOK: 08.AUDIO (C35.1 R32.1 R33.2), 19.IO_Connector (J24.30)
SDMMC0_CLK: 06.MicroSD Card (R11.1), 17.GPIO+VCC_Connector (U33.57)
SDMMC0_CMD: 06.MicroSD Card (CN14A1.3 ED13.1), 17.GPIO+VCC_Connector (U33.62)
SDMMC0_D0: 06.MicroSD Card (CN14A1.7 ED11.1), 17.GPIO+VCC_Connector (U33.63)
SDMMC0_D1: 06.MicroSD Card (CN14A1.8 ED10.1), 17.GPIO+VCC_Connector (U33.67)
SDMMC0_D2/ARMJTAG_TCK: 06.MicroSD Card (CN14A1.1 ED15.1), 17.GPIO+VCC_Connector (U33.69)
SDMMC0_D3/ARMJTAG_TMS: 06.MicroSD Card (CN14A1.2 ED14.1), 17.GPIO+VCC_Connector (U33.61)
SDMMC0_DET_L: 06.MicroSD Card (CN14A1.9 ED9.1), 17.GPIO+VCC_Connector (U33.76)
SDMMC_PWREN: 06.MicroSD Card (R13.2), 17.GPIO+VCC_Connector (U33.75)
SPI0_CSO_MO: 16.40PIN CONNECT (CON1.33), 17.GPIO+VCC_Connector (U33.28)
SPI0_MISO_MO: 16.40PIN CONNECT (CON1.31), 17.GPIO+VCC_Connector (U33.30)
SPI3_CLK_M0: 16.40PIN CONNECT (CON1.23), 17.GPIO+VCC_Connector (U33.38)
SPI3_CSO_M0: 16.40PIN CONNECT (CON1.24), 17.GPIO+VCC_Connector (U33.39)
SPI3_MISO_M0: 11.MIPI_CSI_RX (R79.2), 16.40PIN CONNECT (CON1.21), 17.GPIO+VCC_Connector (U33.40)
SPI3_MOSI_M0: 16.40PIN CONNECT (CON1.19), 17.GPIO+VCC_Connector (U33.44)
SPKN_OUT: 08.AUDIO (J9.2), 19.IO_Connector (J24.58)
SPKP_OUT: 08.AUDIO (J9.1), 19.IO_Connector (J24.60)
SYNC_IN: 16.40PIN CONNECT (U30.8), 17.GPIO+VCC_Connector (U33.16)
SYNC_OUT: 16.40PIN CONNECT (U30.9), 17.GPIO+VCC_Connector (U33.18)
TP_DET_1: 19.IO_Connector (J24.81), 20.MIPI_LCD_TX1 (R66.1)
TP_INT_1: 19.IO_Connector (J24.87), 20.MIPI_LCD_TX1 (RP1.7)
TP_INT_L: 09.LCD_eDP TX (R46.1), 19.IO_Connector (J24.8)
TP_PWR_DET: 09.LCD_eDP TX (R51.2), 19.IO_Connector (J24.24)
TP_RST_1: 19.IO_Connector (J24.89), 20.MIPI_LCD_TX1 (RP1.8)
TP_RST_L: 09.LCD_eDP TX (R45.1), 19.IO_Connector (J24.6)
TV_OUT: 16.40PIN CONNECT (U30.11), 18.High Speed Serial_Connector (U33.111)
UART2_RX: 16.40PIN CONNECT (R168.2), 17.GPIO+VCC_Connector (U33.51)
UART2_TX: 16.40PIN CONNECT (R167.2), 17.GPIO+VCC_Connector (U33.55)
USB2.0_HUB_PWR: 12.USB OTG_ HUB (R107.2 R108.1), 19.IO_Connector (J24.34)
USB2_HOST2_DM: 12.USB OTG_ HUB (U17.14), 19.IO_Connector (J24.65)
USB2_HOST2_DP: 12.USB OTG_ HUB (U17.15), 19.IO_Connector (J24.63)
USB2_HOST3_DM: 13.USB HOST (L10.4 R126.1), 19.IO_Connector (J24.71)
USB2_HOST3_DP: 13.USB HOST (L10.2 R124.1), 19.IO_Connector (J24.69)
USB3_HOST1_DM: 13.USB HOST (L11.1 R128.2), 19.IO_Connector (J24.47)
USB3_HOST1_DP: 13.USB HOST (L11.3 R129.2), 19.IO_Connector (J24.45)
USB3_HOST1_SSRXN: 13.USB HOST (U22.7), 19.IO_Connector (J24.59)
USB3_HOST1_SSRXP: 13.USB HOST (U22.6), 19.IO_Connector (J24.57)
USB3_HOST1_SSTXN: 13.USB HOST (U22.3), 19.IO_Connector (J24.53)
USB3_HOST1_SSTXP: 13.USB HOST (U22.2), 19.IO_Connector (J24.51)
USB_OTG0_DM: 12.USB OTG_ HUB (D19.2 L15.1 R92.2), 18.High Speed Serial_Connector (U33.103)
USB_OTG0_DP: 12.USB OTG_ HUB (D18.2 L15.3 R93.2), 18.High Speed Serial_Connector (U33.105)
USB_OTG0_ID: 12.USB OTG_ HUB (R95.2 R99.2), 18.High Speed Serial_Connector (U33.101)
USB_OTG0_VBUSDET: 12.USB OTG_ HUB (R98.2), 19.IO_Connector (J24.97)
USB_PWR_H: 13.USB HOST (U20.4), 19.IO_Connector (J24.10)
WL_nDis: 16.40PIN CONNECT (U31.1), 17.GPIO+VCC_Connector (U33.89)